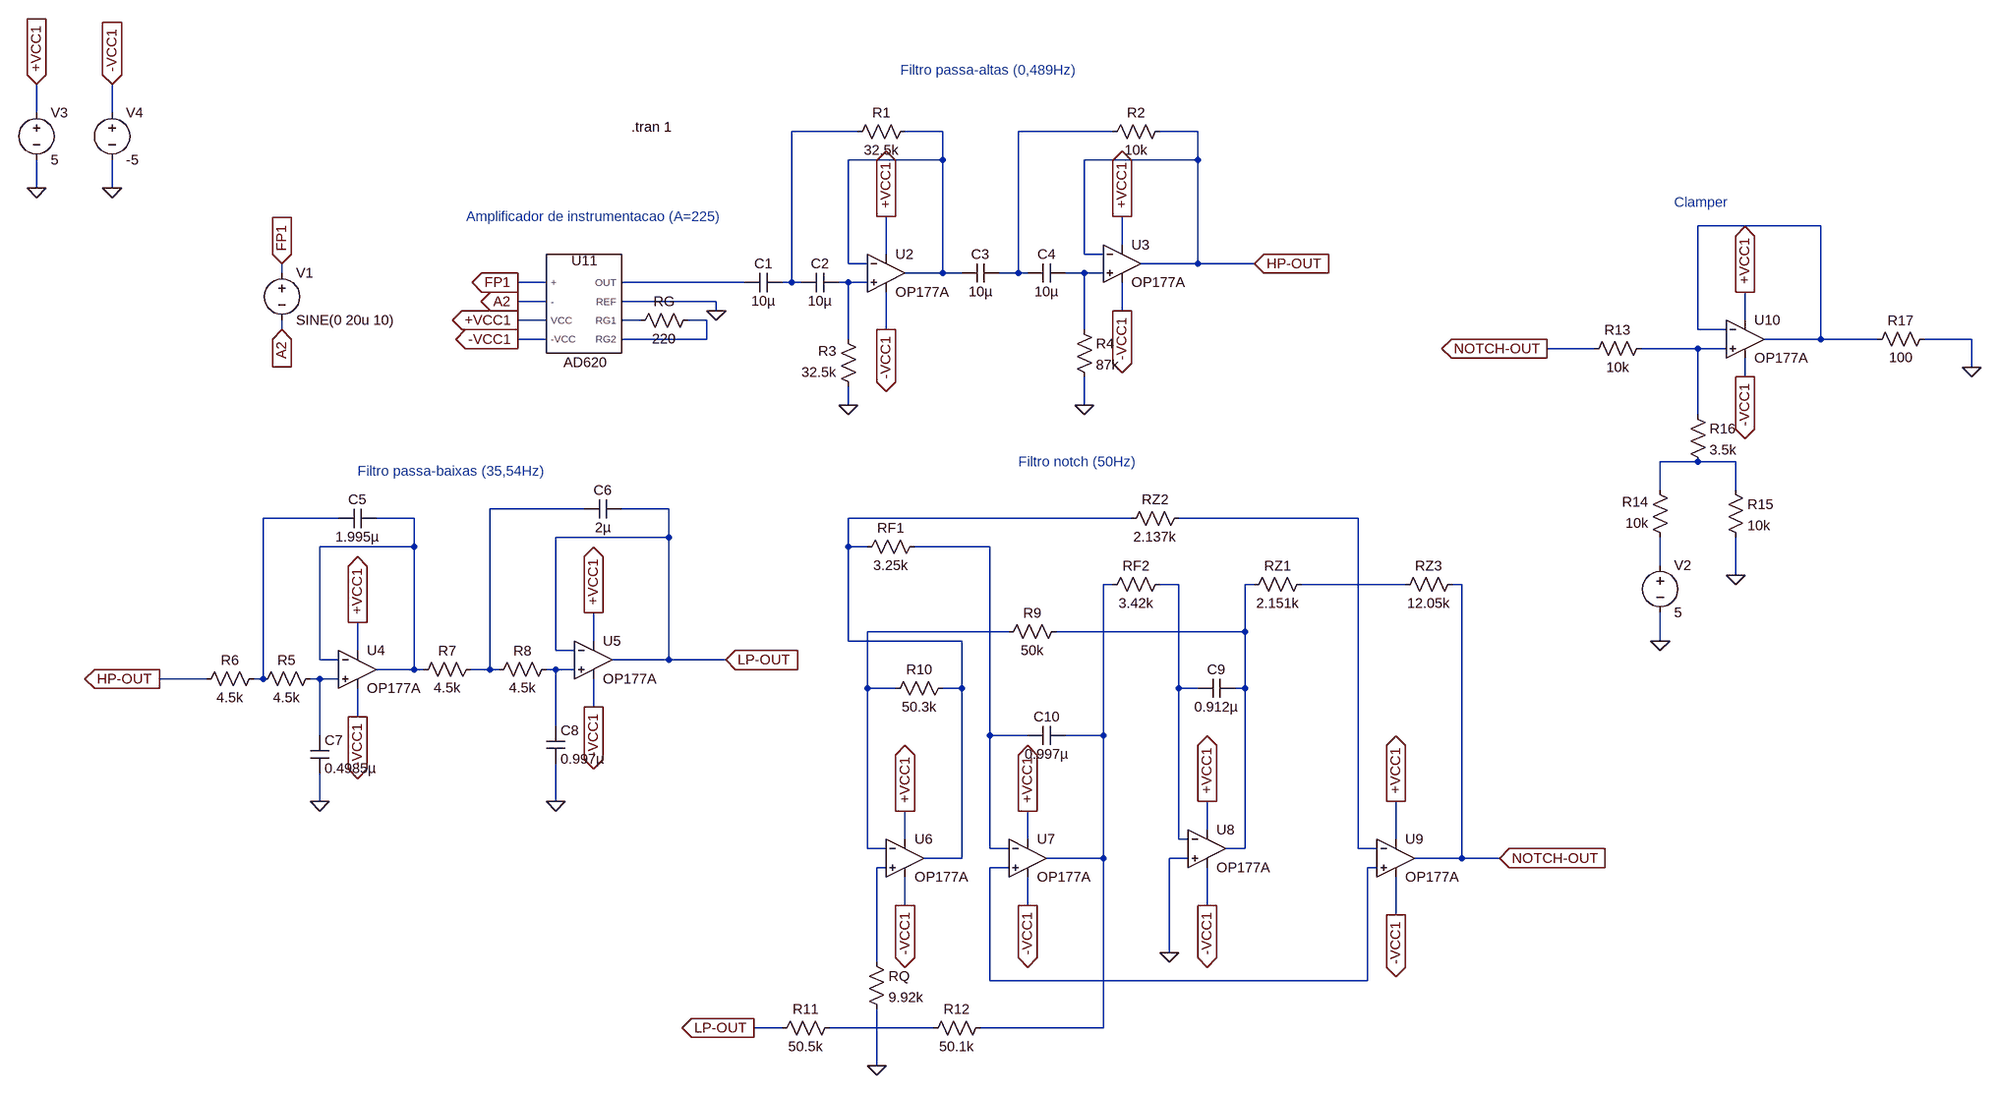
[diagram p0: schematic lteeg_v2.asc]
lteeg_v2.asc, the LTspice schematic file:
Version 4
SHEET 1 2628 3768
WIRE -672 -144 -672 -192
WIRE -544 -144 -544 -192
WIRE 720 -112 608 -112
WIRE 864 -112 800 -112
WIRE 1152 -112 992 -112
WIRE 1296 -112 1232 -112
WIRE 864 -64 864 -112
WIRE 864 -64 704 -64
WIRE 1296 -64 1296 -112
WIRE 1296 -64 1104 -64
WIRE -672 -16 -672 -64
WIRE -544 -16 -544 -64
WIRE 2352 48 2144 48
WIRE 1168 80 1168 32
WIRE 768 96 768 32
WIRE 1104 96 1104 -64
WIRE 1136 96 1104 96
WIRE 704 112 704 -64
WIRE 736 112 704 112
WIRE 1296 112 1296 -64
WIRE 1296 112 1200 112
WIRE 1392 112 1296 112
WIRE -256 128 -256 112
WIRE 864 128 864 -64
WIRE 864 128 800 128
WIRE 896 128 864 128
WIRE 992 128 992 -112
WIRE 992 128 960 128
WIRE 1008 128 992 128
WIRE 1104 128 1072 128
WIRE 1136 128 1104 128
WIRE 192 144 144 144
WIRE 528 144 320 144
WIRE 608 144 608 -112
WIRE 608 144 592 144
WIRE 624 144 608 144
WIRE 704 144 688 144
WIRE 736 144 704 144
WIRE 192 176 144 176
WIRE 480 176 320 176
WIRE 480 192 480 176
WIRE 1168 192 1168 144
WIRE 192 208 144 208
WIRE 352 208 320 208
WIRE 464 208 432 208
WIRE 2224 208 2224 160
WIRE -256 224 -256 208
WIRE 768 224 768 160
WIRE 1104 224 1104 128
WIRE 2144 224 2144 48
WIRE 2192 224 2144 224
WIRE 192 240 144 240
WIRE 464 240 464 208
WIRE 464 240 320 240
WIRE 704 240 704 144
WIRE 2352 240 2352 48
WIRE 2352 240 2256 240
WIRE 2448 240 2352 240
WIRE 2608 240 2528 240
WIRE 1968 256 1888 256
WIRE 2144 256 2048 256
WIRE 2192 256 2144 256
WIRE 2608 288 2608 240
WIRE 2224 304 2224 272
WIRE 704 352 704 320
WIRE 1104 352 1104 304
WIRE 2144 368 2144 256
WIRE 2144 448 2080 448
WIRE 2208 448 2144 448
WIRE 2080 496 2080 448
WIRE 2208 496 2208 448
WIRE 256 528 96 528
WIRE 400 528 320 528
WIRE -160 544 -288 544
WIRE -32 544 -96 544
WIRE 1184 544 704 544
WIRE 1568 544 1264 544
WIRE 400 576 400 528
WIRE 400 576 208 576
WIRE -32 592 -32 544
WIRE -32 592 -192 592
WIRE 704 592 704 544
WIRE 736 592 704 592
WIRE 944 592 816 592
WIRE 2080 624 2080 576
WIRE 2208 640 2208 576
WIRE 1152 656 1136 656
WIRE 1264 656 1232 656
WIRE 1392 656 1376 656
WIRE 1648 656 1472 656
WIRE 1744 656 1728 656
WIRE 976 736 736 736
WIRE 1376 736 1376 656
WIRE 1376 736 1056 736
WIRE 272 752 272 704
WIRE 704 752 704 592
WIRE 896 752 704 752
WIRE 2080 752 2080 704
WIRE -128 768 -128 720
WIRE 208 768 208 576
WIRE 240 768 208 768
WIRE -192 784 -192 592
WIRE -160 784 -192 784
WIRE 400 784 400 576
WIRE 400 784 304 784
WIRE 496 784 400 784
WIRE -32 800 -32 592
WIRE -32 800 -96 800
WIRE -16 800 -32 800
WIRE 96 800 96 528
WIRE 96 800 64 800
WIRE 112 800 96 800
WIRE 208 800 192 800
WIRE 240 800 208 800
WIRE -384 816 -464 816
WIRE -288 816 -288 544
WIRE -288 816 -304 816
WIRE -192 816 -208 816
WIRE -160 816 -192 816
WIRE 736 832 736 736
WIRE 784 832 736 832
WIRE 896 832 896 752
WIRE 896 832 864 832
WIRE 1264 832 1264 656
WIRE 1296 832 1264 832
WIRE 1376 832 1376 736
WIRE 1376 832 1360 832
WIRE 272 864 272 816
WIRE -128 880 -128 832
WIRE 208 896 208 800
WIRE -192 912 -192 816
WIRE 944 912 944 592
WIRE 1008 912 944 912
WIRE 1136 912 1136 656
WIRE 1136 912 1072 912
WIRE -192 1024 -192 976
WIRE 208 1024 208 960
WIRE 1312 1072 1312 1024
WIRE 800 1088 800 1040
WIRE 1008 1088 1008 1040
WIRE 1264 1088 1264 832
WIRE 1280 1088 1264 1088
WIRE 1632 1088 1632 1024
WIRE 736 1104 736 832
WIRE 768 1104 736 1104
WIRE 944 1104 944 912
WIRE 976 1104 944 1104
WIRE 1376 1104 1376 832
WIRE 1376 1104 1344 1104
WIRE 1568 1104 1568 544
WIRE 1600 1104 1568 1104
WIRE 896 1120 896 832
WIRE 896 1120 832 1120
WIRE 1136 1120 1136 912
WIRE 1136 1120 1040 1120
WIRE 1280 1120 1248 1120
WIRE 1744 1120 1744 656
WIRE 1744 1120 1664 1120
WIRE 1808 1120 1744 1120
WIRE 768 1136 752 1136
WIRE 976 1136 944 1136
WIRE 1600 1136 1584 1136
WIRE 800 1200 800 1152
WIRE 1008 1200 1008 1152
WIRE 1312 1200 1312 1136
WIRE 1632 1216 1632 1152
WIRE 1248 1280 1248 1120
WIRE 752 1296 752 1136
WIRE 944 1328 944 1136
WIRE 1584 1328 1584 1136
WIRE 1584 1328 944 1328
WIRE 592 1408 544 1408
WIRE 848 1408 672 1408
WIRE 1136 1408 1136 1120
WIRE 1136 1408 928 1408
WIRE 752 1472 752 1376
FLAG 480 192 0
FLAG -256 112 FP1
IOPIN -256 112 In
FLAG -256 224 A2
IOPIN -256 224 In
FLAG 144 144 FP1
IOPIN 144 144 Out
FLAG 144 176 A2
IOPIN 144 176 Out
FLAG 704 352 0
FLAG 1104 352 0
FLAG 1392 112 HP-OUT
IOPIN 1392 112 In
FLAG -192 1024 0
FLAG 208 1024 0
FLAG -464 816 HP-OUT
IOPIN -464 816 Out
FLAG 1248 1280 0
FLAG 752 1472 0
FLAG 496 784 LP-OUT
IOPIN 496 784 In
FLAG 544 1408 LP-OUT
IOPIN 544 1408 Out
FLAG 2208 640 0
FLAG 1808 1120 NOTCH-OUT
IOPIN 1808 1120 In
FLAG 1888 256 NOTCH-OUT
IOPIN 1888 256 Out
FLAG 2080 752 0
FLAG -544 -16 0
FLAG -672 -16 0
FLAG -672 -192 +VCC1
IOPIN -672 -192 In
FLAG -544 -192 -VCC1
IOPIN -544 -192 In
FLAG 144 208 +VCC1
IOPIN 144 208 Out
FLAG 144 240 -VCC1
IOPIN 144 240 Out
FLAG 768 32 +VCC1
IOPIN 768 32 Out
FLAG 768 224 -VCC1
IOPIN 768 224 Out
FLAG 1168 32 +VCC1
IOPIN 1168 32 Out
FLAG 1168 192 -VCC1
IOPIN 1168 192 Out
FLAG -128 720 +VCC1
IOPIN -128 720 Out
FLAG -128 880 -VCC1
IOPIN -128 880 Out
FLAG 272 704 +VCC1
IOPIN 272 704 Out
FLAG 272 864 -VCC1
IOPIN 272 864 Out
FLAG 800 1040 +VCC1
IOPIN 800 1040 Out
FLAG 800 1200 -VCC1
IOPIN 800 1200 Out
FLAG 1008 1040 +VCC1
IOPIN 1008 1040 Out
FLAG 1312 1024 +VCC1
IOPIN 1312 1024 Out
FLAG 1632 1024 +VCC1
IOPIN 1632 1024 Out
FLAG 1008 1200 -VCC1
IOPIN 1008 1200 Out
FLAG 1312 1200 -VCC1
IOPIN 1312 1200 Out
FLAG 1632 1216 -VCC1
IOPIN 1632 1216 Out
FLAG 2608 288 0
FLAG 2224 160 +VCC1
IOPIN 2224 160 Out
FLAG 2224 304 -VCC1
IOPIN 2224 304 Out
SYMBOL res 448 192 R90
WINDOW 0 0 56 VBottom 2
WINDOW 3 32 56 VTop 2
SYMATTR InstName RG
SYMATTR Value 220
SYMBOL voltage -256 112 R0
WINDOW 123 0 0 Left 0
WINDOW 39 0 0 Left 0
SYMATTR InstName V1
SYMATTR Value SINE(0 20u 10)
SYMBOL OpAmps\\OP177A 768 64 R0
SYMATTR InstName U2
SYMBOL OpAmps\\OP177A 1168 48 R0
SYMATTR InstName U3
SYMBOL cap 592 128 R90
WINDOW 0 0 32 VBottom 2
WINDOW 3 32 32 VTop 2
SYMATTR InstName C1
SYMATTR Value 10µ
SYMBOL cap 688 128 R90
WINDOW 0 0 32 VBottom 2
WINDOW 3 32 32 VTop 2
SYMATTR InstName C2
SYMATTR Value 10µ
SYMBOL res 816 -128 R90
WINDOW 0 0 56 VBottom 2
WINDOW 3 32 56 VTop 2
SYMATTR InstName R1
SYMATTR Value 32.5k
SYMBOL res 1248 -128 R90
WINDOW 0 0 56 VBottom 2
WINDOW 3 32 56 VTop 2
SYMATTR InstName R2
SYMATTR Value 10k
SYMBOL res 720 336 R180
WINDOW 0 36 76 Left 2
WINDOW 3 36 40 Left 2
SYMATTR InstName R3
SYMATTR Value 32.5k
SYMBOL cap 960 112 R90
WINDOW 0 0 32 VBottom 2
WINDOW 3 32 32 VTop 2
SYMATTR InstName C3
SYMATTR Value 10µ
SYMBOL cap 1072 112 R90
WINDOW 0 0 32 VBottom 2
WINDOW 3 32 32 VTop 2
SYMATTR InstName C4
SYMATTR Value 10µ
SYMBOL res 1088 208 R0
SYMATTR InstName R4
SYMATTR Value 87k
SYMBOL OpAmps\\OP177A -128 736 R0
SYMATTR InstName U4
SYMBOL OpAmps\\OP177A 272 720 R0
SYMATTR InstName U5
SYMBOL res -192 800 R90
WINDOW 0 0 56 VBottom 2
WINDOW 3 32 56 VTop 2
SYMATTR InstName R5
SYMATTR Value 4.5k
SYMBOL res -288 800 R90
WINDOW 0 0 56 VBottom 2
WINDOW 3 32 56 VTop 2
SYMATTR InstName R6
SYMATTR Value 4.5k
SYMBOL cap 320 512 R90
WINDOW 0 0 32 VBottom 2
WINDOW 3 32 32 VTop 2
SYMATTR InstName C6
SYMATTR Value 2µ
SYMBOL cap -160 528 M90
WINDOW 0 0 32 VBottom 2
WINDOW 3 32 32 VTop 2
SYMATTR InstName C5
SYMATTR Value 1.995µ
SYMBOL cap -208 912 R0
SYMATTR InstName C7
SYMATTR Value 0.4985µ
SYMBOL cap 192 896 R0
SYMATTR InstName C8
SYMATTR Value 0.997µ
SYMBOL res 80 784 R90
WINDOW 0 0 56 VBottom 2
WINDOW 3 32 56 VTop 2
SYMATTR InstName R7
SYMATTR Value 4.5k
SYMBOL res 208 784 R90
WINDOW 0 0 56 VBottom 2
WINDOW 3 32 56 VTop 2
SYMATTR InstName R8
SYMATTR Value 4.5k
SYMBOL OpAmps\\OP177A 800 1056 R0
SYMATTR InstName U6
SYMBOL OpAmps\\OP177A 1008 1056 R0
SYMATTR InstName U7
SYMBOL OpAmps\\OP177A 1312 1040 R0
SYMATTR InstName U8
SYMBOL OpAmps\\OP177A 1632 1056 R0
SYMATTR InstName U9
SYMBOL res 1280 528 R90
WINDOW 0 0 56 VBottom 2
WINDOW 3 32 56 VTop 2
SYMATTR InstName RZ2
SYMATTR Value 2.137k
SYMBOL res 832 576 R90
WINDOW 0 0 56 VBottom 2
WINDOW 3 32 56 VTop 2
SYMATTR InstName RF1
SYMATTR Value 3.25k
SYMBOL res 1248 640 R90
WINDOW 0 0 56 VBottom 2
WINDOW 3 32 56 VTop 2
SYMATTR InstName RF2
SYMATTR Value 3.42k
SYMBOL res 1072 720 R90
WINDOW 0 0 56 VBottom 2
WINDOW 3 32 56 VTop 2
SYMATTR InstName R9
SYMATTR Value 50k
SYMBOL res 880 816 R90
WINDOW 0 0 56 VBottom 2
WINDOW 3 32 56 VTop 2
SYMATTR InstName R10
SYMATTR Value 50.3k
SYMBOL res 736 1280 R0
SYMATTR InstName RQ
SYMATTR Value 9.92k
SYMBOL res 1488 640 R90
WINDOW 0 0 56 VBottom 2
WINDOW 3 32 56 VTop 2
SYMATTR InstName RZ1
SYMATTR Value 2.151k
SYMBOL res 1744 640 R90
WINDOW 0 0 56 VBottom 2
WINDOW 3 32 56 VTop 2
SYMATTR InstName RZ3
SYMATTR Value 12.05k
SYMBOL cap 1360 816 R90
WINDOW 0 0 32 VBottom 2
WINDOW 3 32 32 VTop 2
SYMATTR InstName C9
SYMATTR Value 0.912µ
SYMBOL res 688 1392 R90
WINDOW 0 0 56 VBottom 2
WINDOW 3 32 56 VTop 2
SYMATTR InstName R11
SYMATTR Value 50.5k
SYMBOL res 944 1392 R90
WINDOW 0 0 56 VBottom 2
WINDOW 3 32 56 VTop 2
SYMATTR InstName R12
SYMATTR Value 50.1k
SYMBOL cap 1072 896 R90
WINDOW 0 0 32 VBottom 2
WINDOW 3 32 32 VTop 2
SYMATTR InstName C10
SYMATTR Value 0.997µ
SYMBOL OpAmps\\OP177A 2224 176 R0
SYMATTR InstName U10
SYMBOL res 2064 240 R90
WINDOW 0 0 56 VBottom 2
WINDOW 3 32 56 VTop 2
SYMATTR InstName R13
SYMATTR Value 10k
SYMBOL res 2096 592 R180
WINDOW 0 36 76 Left 2
WINDOW 3 36 40 Left 2
SYMATTR InstName R14
SYMATTR Value 10k
SYMBOL res 2192 480 R0
SYMATTR InstName R15
SYMATTR Value 10k
SYMBOL res 2128 352 R0
SYMATTR InstName R16
SYMATTR Value 3.5k
SYMBOL voltage 2080 608 R0
WINDOW 123 0 0 Left 0
WINDOW 39 0 0 Left 0
SYMATTR InstName V2
SYMATTR Value 5
SYMBOL voltage -672 -160 R0
WINDOW 123 0 0 Left 0
WINDOW 39 0 0 Left 0
SYMATTR InstName V3
SYMATTR Value 5
SYMBOL voltage -544 -160 R0
WINDOW 123 0 0 Left 0
WINDOW 39 0 0 Left 0
SYMATTR InstName V4
SYMATTR Value -5
SYMBOL res 2544 224 R90
WINDOW 0 0 56 VBottom 2
WINDOW 3 32 56 VTop 2
SYMATTR InstName R17
SYMATTR Value 100
SYMBOL AD620 272 192 R0
SYMATTR InstName U11
TEXT 56 32 Left 2 ;Amplificador de instrumentacao (A=225)
TEXT 792 -216 Left 2 ;Filtro passa-altas (0,489Hz)
TEXT -128 464 Left 2 ;Filtro passa-baixas (35,54Hz)
TEXT 992 448 Left 2 ;Filtro notch (50Hz)
TEXT 2104 8 Left 2 ;Clamper
TEXT 336 -120 Left 2 !.tran 1

The netlist it stands for:
* lteeg_v2.asc
RG N009 N008 220
V1 FP1 A2 SINE(0 20u 10)
XU2 N007 N002 +VCC1 -VCC1 N002 OP177A  ; pins In+ In- V+ V- OUT
XU3 N005 HP-OUT +VCC1 -VCC1 HP-OUT OP177A  ; pins In+ In- V+ V- OUT
C1 N001 N006 10µ
C2 N007 N001 10µ
R1 N002 N001 32.5k
R2 HP-OUT N003 10k
R3 0 N007 32.5k
C3 N003 N002 10µ
C4 N005 N003 10µ
R4 N005 0 87k
XU4 N025 N014 +VCC1 -VCC1 N014 OP177A  ; pins In+ In- V+ V- OUT
XU5 N024 LP-OUT +VCC1 -VCC1 LP-OUT OP177A  ; pins In+ In- V+ V- OUT
R5 N025 N013 4.5k
R6 N013 HP-OUT 4.5k
C6 LP-OUT N012 2µ
C5 N013 N014 1.995µ
C7 N025 0 0.4985µ
C8 N024 0 0.997µ
R7 N012 N014 4.5k
R8 N024 N012 4.5k
XU6 N026 N023 +VCC1 -VCC1 N015 OP177A  ; pins In+ In- V+ V- OUT
XU7 N027 N017 +VCC1 -VCC1 N019 OP177A  ; pins In+ In- V+ V- OUT
XU8 0 N020 +VCC1 -VCC1 N021 OP177A  ; pins In+ In- V+ V- OUT
XU9 N027 N016 +VCC1 -VCC1 NOTCH-OUT OP177A  ; pins In+ In- V+ V- OUT
RZ2 N016 N015 2.137k
RF1 N017 N015 3.25k
RF2 N020 N019 3.42k
R9 N021 N023 50k
R10 N015 N023 50.3k
RQ N026 0 9.92k
RZ1 N022 N021 2.151k
RZ3 NOTCH-OUT N022 12.05k
C9 N021 N020 0.912µ
R11 N028 LP-OUT 50.5k
R12 N019 N028 50.1k
C10 N019 N017 0.997µ
XU10 N010 N004 +VCC1 -VCC1 N004 OP177A  ; pins In+ In- V+ V- OUT
R13 N010 NOTCH-OUT 10k
R14 N018 N011 10k
R15 N011 0 10k
R16 N010 N011 3.5k
V2 N018 0 5
V3 +VCC1 0 5
V4 -VCC1 0 -5
R17 0 N004 100
XU11 FP1 A2 +VCC1 -VCC1 N006 0 N008 N009 AD620  ; pins + - VCC -VCC OUT REF RG1 RG2
* Amplificador de instrumentacao (A=225)
* Filtro passa-altas (0,489Hz)
* Filtro passa-baixas (35,54Hz)
* Filtro notch (50Hz)
* Clamper
.tran 1
.lib Z:\20221750037\Downloads\ad620.cir
.backanno
.end